# Altium schematic sheet SPI_LOGIC.SchDoc
size Tabloid; SheetNumber: 7; SheetTotal: 9
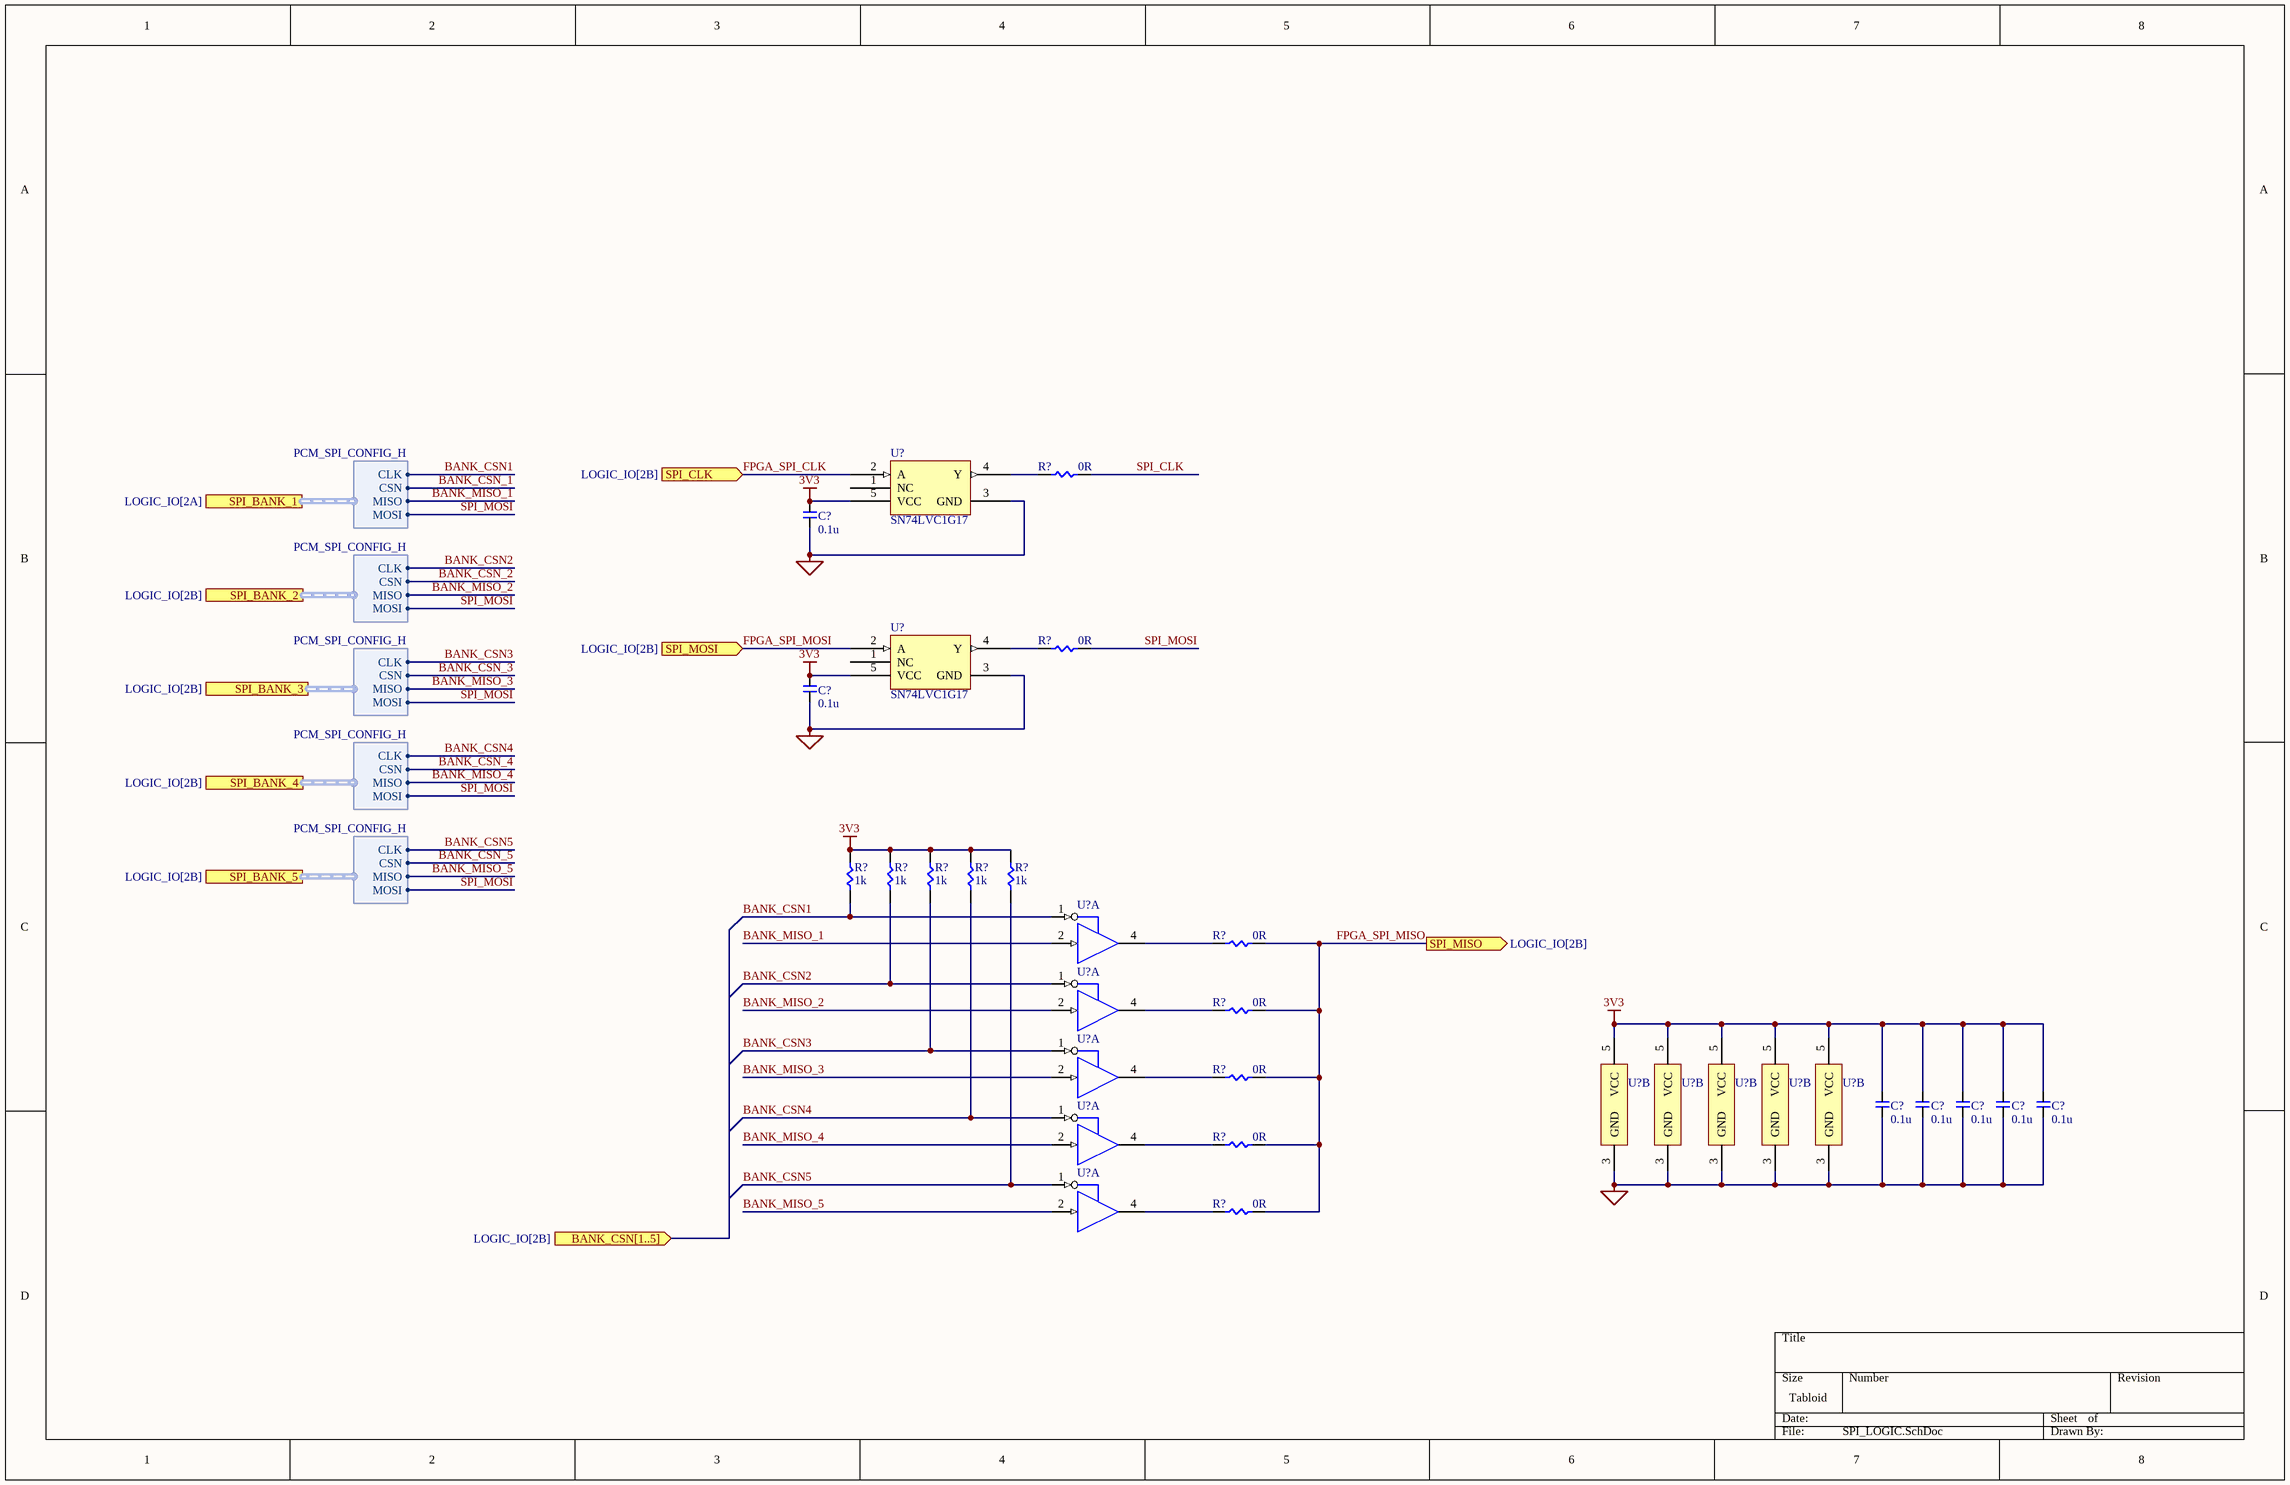
[diagram p0: SPI_LOGIC.SchDoc]

## Parts
(Parts that share a designator on the sheet are numbered #1, #2 ... from top to bottom, then left to right.)
C?#1  0.1u  [CAP_0402]
C?#2  0.1u  [CAP_0402]
C?#3  0.1u  [CAP_0402]
C?#4  0.1u  [CAP_0402]
C?#5  0.1u  [CAP_0402]
C?#6  0.1u  [CAP_0402]
C?#7  0.1u  [CAP_0402]
R?#1  0R  [RES_0402]
R?#2  0R  [RES_0402]
R?#3  1k  [RES_0402]
R?#4  1k  [RES_0402]
R?#5  1k  [RES_0402]
R?#6  1k  [RES_0402]
R?#7  1k  [RES_0402]
R?#8  0R  [RES_0402]
R?#9  0R  [RES_0402]
R?#10  0R  [RES_0402]
R?#11  0R  [RES_0402]
R?#12  0R  [RES_0402]
U?#1  SN74LVC1G17
U?#2  SN74LVC1G17
U?#3  SN74AUP1G125DRLR  [DRL0005A_N]  (value not drawn)  (part A of 2)
U?#4  SN74AUP1G125DRLR  [DRL0005A_N]  (value not drawn)  (part A of 2)
U?#5  SN74AUP1G125DRLR  [DRL0005A_N]  (value not drawn)  (part A of 2)
U?#6  SN74AUP1G125DRLR  [DRL0005A_N]  (value not drawn)  (part B of 2)
U?#7  SN74AUP1G125DRLR  [DRL0005A_N]  (value not drawn)  (part B of 2)
U?#8  SN74AUP1G125DRLR  [DRL0005A_N]  (value not drawn)  (part B of 2)
U?#9  SN74AUP1G125DRLR  [DRL0005A_N]  (value not drawn)  (part B of 2)
U?#10  SN74AUP1G125DRLR  [DRL0005A_N]  (value not drawn)  (part B of 2)
U?#11  SN74AUP1G125DRLR  [DRL0005A_N]  (value not drawn)  (part A of 2)
U?#12  SN74AUP1G125DRLR  [DRL0005A_N]  (value not drawn)  (part A of 2)

## Ports
BANK_CSN[1..5] (in, see LOGIC_IO[2B]), SPI_BANK_1 (harness PCM_SPI_CONFIG_H, see LOGIC_IO[2A]), SPI_BANK_2 (harness PCM_SPI_CONFIG_H, see LOGIC_IO[2B]), SPI_BANK_3 (harness PCM_SPI_CONFIG_H, see LOGIC_IO[2B]), SPI_BANK_4 (harness PCM_SPI_CONFIG_H, see LOGIC_IO[2B]), SPI_BANK_5 (harness PCM_SPI_CONFIG_H, see LOGIC_IO[2B]), SPI_CLK (in, see LOGIC_IO[2B]), SPI_MISO (out, see LOGIC_IO[2B]), SPI_MOSI (in, see LOGIC_IO[2B])

## Harnesses
PCM_SPI_CONFIG_H: CLK, CSN, MISO, MOSI

## Nets
3V3: C?#1.2 C?#2.2 C?#3.2 C?#4.2 C?#5.2 C?#6.2 C?#7.2 R?#3.1 R?#4.1 R?#5.1 R?#6.1 R?#7.1 U?#1.5(VCC) U?#2.5(VCC) U?#6.5(VCC) U?#7.5(VCC) U?#8.5(VCC) U?#9.5(VCC) U?#10.5(VCC)
GND: C?#1.1 C?#2.1 C?#3.1 C?#4.1 C?#5.1 C?#6.1 C?#7.1 U?#1.3(GND) U?#2.3(GND) U?#6.3(GND) U?#7.3(GND) U?#8.3(GND) U?#9.3(GND) U?#10.3(GND)
BANK_CSN1: R?#3.0 U?#3.1(~{OE}) ; port SPI_BANK_1.CLK
BANK_CSN2: R?#4.0 U?#4.1(~{OE}) ; port SPI_BANK_2.CLK
BANK_CSN3: R?#5.0 U?#5.1(~{OE}) ; port SPI_BANK_3.CLK
BANK_CSN4: R?#6.0 U?#11.1(~{OE}) ; port SPI_BANK_4.CLK
BANK_CSN5: R?#7.0 U?#12.1(~{OE}) ; port SPI_BANK_5.CLK
BANK_CSN_1: port SPI_BANK_1.CSN
BANK_CSN_2: port SPI_BANK_2.CSN
BANK_CSN_3: port SPI_BANK_3.CSN
BANK_CSN_4: port SPI_BANK_4.CSN
BANK_CSN_5: port SPI_BANK_5.CSN
BANK_MISO_1: U?#3.2(A) ; port SPI_BANK_1.MISO
BANK_MISO_2: U?#4.2(A) ; port SPI_BANK_2.MISO
BANK_MISO_3: U?#5.2(A) ; port SPI_BANK_3.MISO
BANK_MISO_4: U?#11.2(A) ; port SPI_BANK_4.MISO
BANK_MISO_5: U?#12.2(A) ; port SPI_BANK_5.MISO
FPGA_SPI_CLK: U?#1.2(A) ; port SPI_CLK
FPGA_SPI_MISO: R?#8.1 R?#9.1 R?#10.1 R?#11.1 R?#12.1 ; port SPI_MISO
FPGA_SPI_MOSI: U?#2.2(A) ; port SPI_MOSI
SPI_CLK: R?#1.1
SPI_MOSI: R?#2.1 ; port SPI_BANK_1.MOSI, port SPI_BANK_2.MOSI, port SPI_BANK_3.MOSI, port SPI_BANK_4.MOSI, port SPI_BANK_5.MOSI
NetR?#1_0: R?#1.0 U?#1.4(Y)
NetR?#2_0: R?#2.0 U?#2.4(Y)
NetR?#8_0: R?#8.0 U?#3.4(Y)
NetR?#9_0: R?#9.0 U?#4.4(Y)
NetR?#10_0: R?#10.0 U?#5.4(Y)
NetR?#11_0: R?#11.0 U?#11.4(Y)
NetR?#12_0: R?#12.0 U?#12.4(Y)

Not connected (* = marked no-connect by the designer): U?#1 1(NC); U?#2 1(NC)

## Library data of the parts
C?#1-C?#7 = 0.1u: CAP CER 0.1uF 6V X7R 0402 10%
R?#1-R?#12 = RES_0402: RES SMD 0402; Manufacturer: *; Part Number: *; Power Rating: *
U?#1 U?#2 = SN74LVC1G17: Schmitt-trigger buffer, DBV, DCK, DRL, DPW package
U?#3-U?#12 = CMP-0859-00778-3: Low-Power Single Bus Buffer Gate with 3-State Output, DRL0005A, LARGE T&R; Manufacturer: Texas Instruments; Bits(#): 1; Output Drive (IOL/IOH)(Max)(mA): 20/-20; ICC @ Nom Voltage(Max)(mA): 0.0009; Input Type: CMOS; Schmitt Trigger: No; Logic: True; 3-State Output: Yes; Sub-Family: Non-Inverting Buffer/Driver; Voltage(Nom)(V): 0.8,1.2,1.5,1.8,2.5,3.3; F @ Nom Voltage(Max)(Mhz): 100; Rating: Catalog; VCC(Max)(V): 3.6; Technology Family: AUP; VCC(Min)(V): 0.8; tpd @ Nom Voltage(Max)(ns): 29,18.7,12.5,10.1,7.2,6; Operating Temperature Range(C): -40 to 85; PackageReference: DRL0005A; Output Type: CMOS; DatasheetVersion: SCES595L; Generic Part Number: SN74AUP1G125